# Altium schematic sheet FPGA5.SchDoc: FPGA-5
size A; Revision: 04
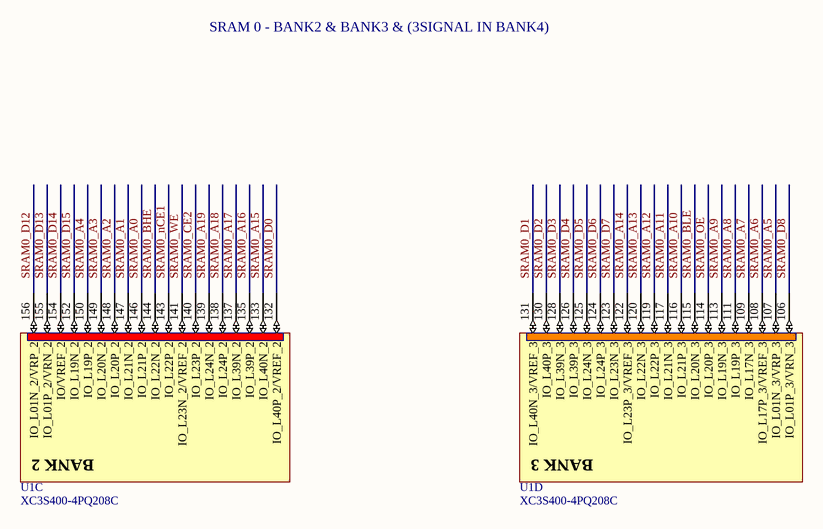
[diagram p0: FPGA5.SchDoc]

## Parts
U1  XC3S400-4PQ208C  [PQ208_N]  (parts C,D of 11)

## Nets
SRAM0_A0: U1.146(IO_L21P_2)
SRAM0_A1: U1.147(IO_L21N_2)
SRAM0_A2: U1.148(IO_L20P_2)
SRAM0_A3: U1.149(IO_L20N_2)
SRAM0_A4: U1.150(IO_L19P_2)
SRAM0_A5: U1.107(IO_L01N_3/VRP_3)
SRAM0_A6: U1.108(IO_L17P_3/VREF_3)
SRAM0_A7: U1.109(IO_L17N_3)
SRAM0_A8: U1.111(IO_L19P_3)
SRAM0_A9: U1.113(IO_L19N_3)
SRAM0_A10: U1.116(IO_L21P_3)
SRAM0_A11: U1.117(IO_L21N_3)
SRAM0_A12: U1.119(IO_L22P_3)
SRAM0_A13: U1.120(IO_L22N_3)
SRAM0_A14: U1.122(IO_L23P_3/VREF_3)
SRAM0_A15: U1.133(IO_L40N_2)
SRAM0_A16: U1.135(IO_L39P_2)
SRAM0_A17: U1.137(IO_L39N_2)
SRAM0_A18: U1.138(IO_L24P_2)
SRAM0_A19: U1.139(IO_L24N_2)
SRAM0_BHE: U1.144(IO_L22N_2)
SRAM0_BLE: U1.115(IO_L20N_3)
SRAM0_CE2: U1.140(IO_L23P_2)
SRAM0_D0: U1.132(IO_L40P_2/VREF_2)
SRAM0_D1: U1.131(IO_L40N_3/VREF_3)
SRAM0_D2: U1.130(IO_L40P_3)
SRAM0_D3: U1.128(IO_L39N_3)
SRAM0_D4: U1.126(IO_L39P_3)
SRAM0_D5: U1.125(IO_L24N_3)
SRAM0_D6: U1.124(IO_L24P_3)
SRAM0_D7: U1.123(IO_L23N_3)
SRAM0_D8: U1.106(IO_L01P_3/VRN_3)
SRAM0_D12: U1.156(IO_L01N_2/VRP_2)
SRAM0_D13: U1.155(IO_L01P_2/VRN_2)
SRAM0_D14: U1.154(IO/VREF_2)
SRAM0_D15: U1.152(IO_L19N_2)
SRAM0_nCE1: U1.143(IO_L22P_2)
SRAM0_OE: U1.114(IO_L20P_3)
SRAM0_WE: U1.141(IO_L23N_2/VREF_2)

## Notes on the sheet
- SRAM 0 - BANK2 & BANK3 & (3SIGNAL IN BANK4)
- Engineer:
- Title:
- Saleh Jamali
- Revision:
- (in symbol XC3S400-4PQ208C, part C) BANK 2
- (in symbol XC3S400-4PQ208C, part D) BANK 3

## Library data of the parts
U1 = XC3S400-4PQ208C: Spartan-3 1.2V FPGA, 141 User I/Os, 208-Pin PQFP, Standard Performance, Commercial Grade; OrderingInformation: Additional code may have to be appended for different mask revision devices.; DatasheetVersion: ver2.5, Dec-2009; PackageVersion: ver1.2, Jun-2004; PackageReference: PQ208; PackageDescription: 208-Pin Plastic Quad Flat Pack (PQ208); Code_JEDEC: MS-029-FA-1; ComponentLink1Description: Manufacturer URL; ComponentLink1URL: http://www.xilinx.com/; ComponentLink2Description: Spartan-3 Datasheet; ComponentLink2URL: http://www.xilinx.com/support/documentation/data_sheets/ds099.pdf; ComponentLink3Description: PQ208 Package Drawing; ComponentLink3URL: http://www.xilinx.com/support/documentation/package_specs/pq208.pdf; ComponentLink4Description: Spartan-3 Documents; ComponentLink4URL: http://www.xilinx.com/support/documentation/spartan-3.htm